# Altium schematic sheet 蓝牙钥匙球锁20714.SchDoc
size A2
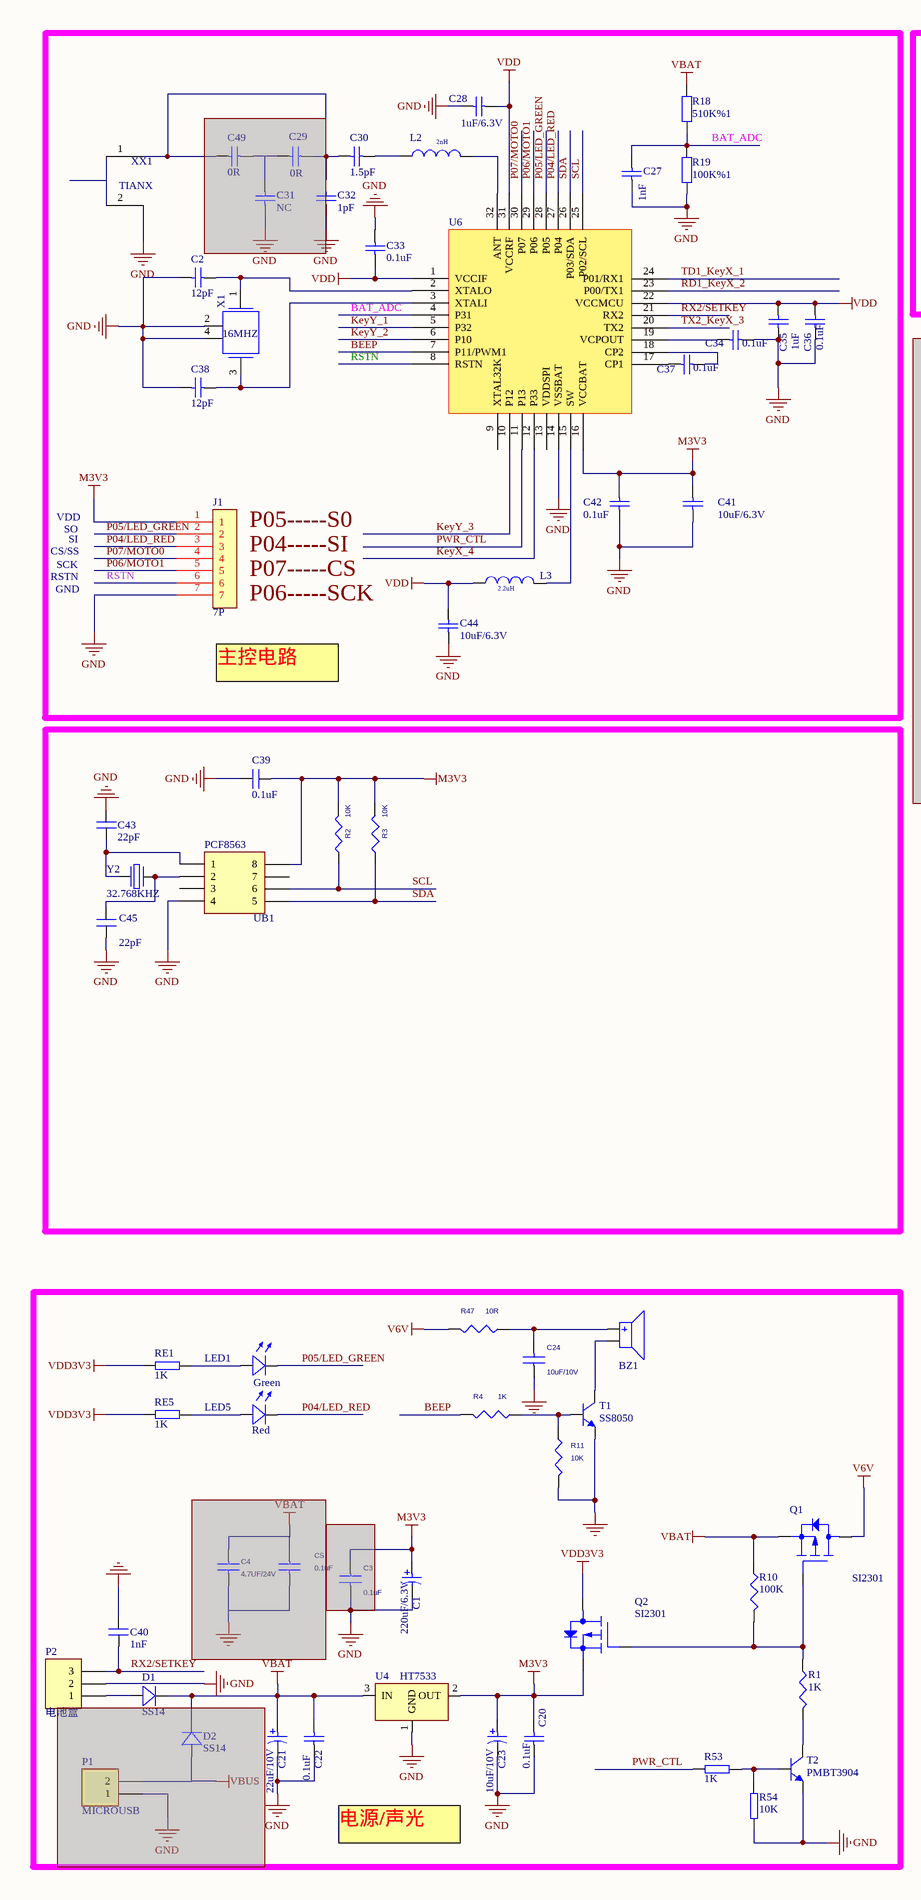
[diagram p0: 蓝牙钥匙球锁20714.SchDoc, left]
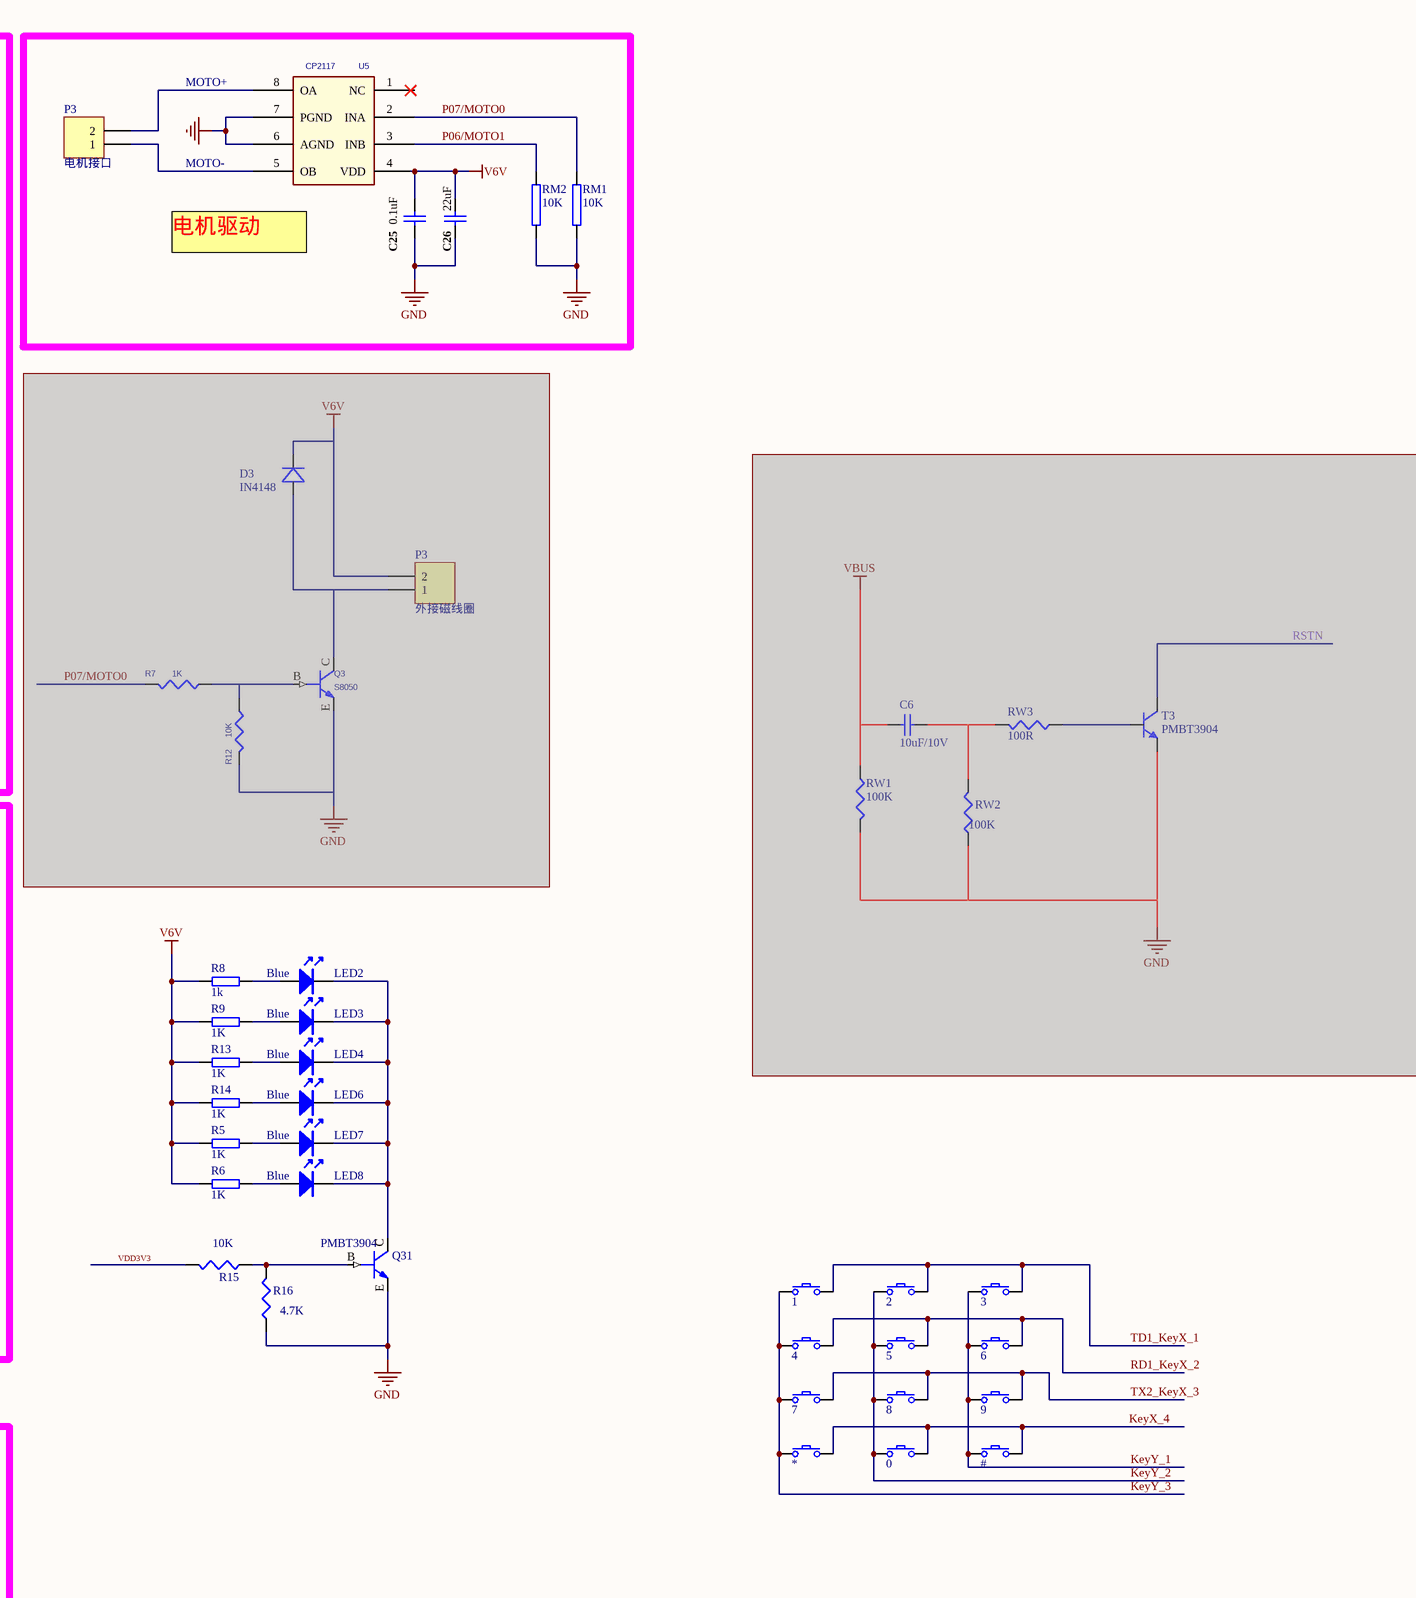
[diagram p1: 蓝牙钥匙球锁20714.SchDoc, right]

## Parts
(Parts that share a designator on the sheet are numbered #1, #2 ... from top to bottom, then left to right.)
0  SW  [KEY_5.2*3.7*6.4]  (value not drawn)
1  SW  [KEY_5.2*3.7*6.4]  (value not drawn)
2  SW  [KEY_5.2*3.7*6.4]  (value not drawn)
3  SW  [KEY_5.2*3.7*6.4]  (value not drawn)
4  SW  [KEY_5.2*3.7*6.4]  (value not drawn)
5  SW  [KEY_5.2*3.7*6.4]  (value not drawn)
6  SW  [KEY_5.2*3.7*6.4]  (value not drawn)
7  SW  [KEY_5.2*3.7*6.4]  (value not drawn)
8  SW  [KEY_5.2*3.7*6.4]  (value not drawn)
9  SW  [KEY_5.2*3.7*6.4]  (value not drawn)
#  SW  [KEY_5.2*3.7*6.4]  (value not drawn)
*  SW  [KEY_5.2*3.7*6.4]  (value not drawn)
BZ1  BUZZER  [BUZZER_D93_L40]  (value not drawn)
C1  220uF/6.3V  [R5*5.8]
C2  12pF  [0402C]
C3  0.1uF  [0402C]  (masked out: inside a compile mask, not in the netlist)
C4  4.7UF/24V  [0603C]  (masked out: inside a compile mask, not in the netlist)
C5  0.1uF  [0402C]  (masked out: inside a compile mask, not in the netlist)
C6  10uF/10V  [0603C]  (masked out: inside a compile mask, not in the netlist)
C20  0.1uF  [0402C]
C21  22uF/10V  [0603C]
C22  0.1uF  [0402C]
C23  10uF/10V  [0603C]
C24  10uF/10V  [0402C]
C25  0.1uF  [0603C]
C26  22uF  [0805C]
C27  1nF  [0402C]
C28  1uF/6.3V  [0402C]
C29  0R  [0402C]  (masked out: inside a compile mask, not in the netlist)
C30  1.5pF  [0603C]
C31  NC  [0402C]  (masked out: inside a compile mask, not in the netlist)
C32  1pF  [0603C]  (masked out: inside a compile mask, not in the netlist)
C33  0.1uF  [0402C]
C34  0.1uF  [0402C]
C35  1uF  [0402C]
C36  0.1uF  [0402C]
C37  0.1uF  [0402C]
C38  12pF  [0402C]
C39  0.1uF  [0402C]
C40  1nF  [0402C]
C41  10uF/6.3V  [0603C]
C42  0.1uF  [0402C]
C43  22pF  [0402C]
C44  10uF/6.3V  [0402C]
C45  22pF  [0402C]
C49  0R  [0402C]  (masked out: inside a compile mask, not in the netlist)
D1  SS14  [DO-214AA]
D2  SS14  [DO-214AA]  (masked out: inside a compile mask, not in the netlist)
D3  IN4148  [SOD-123]  (masked out: inside a compile mask, not in the netlist)
J1  7P  [7P-2.0MM]
L2  2nH  [0603L]
L3  2.2uH  [0603L]
LED1  Green  [0603LED]
LED2  Blue  [0603LED]
LED3  Blue  [0603LED]
LED4  Blue  [0603LED]
LED5  Red  [0603LED]
LED6  Blue  [0603LED]
LED7  Blue  [0603LED]
LED8  Blue  [0603LED]
P1  MICROUSB  [yingjix]  (masked out: inside a compile mask, not in the netlist)
P2  电池盒  [3PIN-2.0J]
P3#1  电机接口  [2-1.27]
P3#2  外接磁线圈  [B2B-PH]  (masked out: inside a compile mask, not in the netlist)
Q1  SI2301  [SOT-23 - GDS]
Q2  SI2301  [SOT-23 - GDS]
Q3  S8050  [SOT-23 - BCE]  (masked out: inside a compile mask, not in the netlist)
Q31  PMBT3904  [SOT-23 - BCE]
R1  1K  [0402R]
R2  10K  [0402R]
R3  10K  [0402R]
R4  1K  [0402R]
R5  1K  [0402R]
R6  1K  [0402R]
R7  1K  [0402R]  (masked out: inside a compile mask, not in the netlist)
R8  1k  [0402R]
R9  1K  [0402R]
R10  100K  [0402R]
R11  10K  [0402R]
R12  10K  [0402R]  (masked out: inside a compile mask, not in the netlist)
R13  1K  [0402R]
R14  1K  [0402R]
R15  10K  [0402R]
R16  4.7K  [0402R]
R18  510K%1  [0402R]
R19  100K%1  [0402R]
R47  10R  [0402R]
R53  1K  [0402R]
R54  10K  [0402R]
RE1  1K  [0402R]
RE5  1K  [0402R]
RM1  10K  [0603R]
RM2  10K  [0603R]
RW1  100K  [0402R]  (masked out: inside a compile mask, not in the netlist)
RW2  100K  [0402R]  (masked out: inside a compile mask, not in the netlist)
RW3  100R  [0402R]  (masked out: inside a compile mask, not in the netlist)
T1  SS8050  [SOT-23-3L]
T2  PMBT3904  [SOT-23-3L]
T3  PMBT3904  [SOT-23-3L]  (masked out: inside a compile mask, not in the netlist)
U4  HT7533  [SOT-23-3L]
U5  CP2117  [SOP8-2]
U6  BK3431Q  [QFN32_4*4*0.4]  (value not drawn)
UB1  PCF8563  [MSOP-8]
X1  16MHZ  [XTAL3225]
XX1  TIANX  [BT_NAMI_1]
Y2  32.768KHZ  [晶振-9]

## Nets
GND: C1.2 C2.1 C20.2 C21.2 C22.2 C23.2 C24.1 C25.2 C26.2 C27.1 C28.1 C33.1 C34.2 C35.1 C36.1 C38.1 C39.2 C40.2 C41.2 C42.2 C43.2 C44.1 C45.1 J1.7 P2.2 Q31.E(EMITTER) R11.2 R16.1 R19.2 R54.1 RM1.1 RM2.1 T1.2 T2.2 U4.1(GND) U5.6(AGND) U5.7(PGND) U6.14(VSSBAT) UB1.4 X1.2 X1.4 XX1.2
M3V3: C1.1 C20.1 C23.1 C39.1 C41.1 C42.1 J1.1 Q2.S(SOURCE) R2.1 R3.1 U4.2(OUT) U6.16(VCCBAT) UB1.8
V6V: C25.1 C26.1 Q1.D(DRAIN) R5.1 R6.1 R8.1 R9.1 R13.1 R14.1 R47.2 U5.4(VDD)
VBAT: C21.1 C22.1 D1.2(K) Q1.S(SOURCE) R10.1 R18.1 U4.3(IN)
VDD: C28.2 C33.2 C35.2 C36.2 C44.2 L3.1(P1) U6.1(VCCIF) U6.22(VCCMCU) U6.31(VCCRF)
VDD3V3: Q2.D(DRAIN) R15.2 RE1.1 RE5.1
BAT_ADC: C27.2 R18.2 R19.1 U6.4(P31)
BEEP: R4.2 U6.7(P11/PWM1)
KeyX_4: 0.2 #.2 *.2 U6.12(P33)
KeyY_1: 3.1 6.1 9.1 #.1 U6.5(P32)
KeyY_2: 0.1 2.1 5.1 8.1 U6.6(P10)
KeyY_3: 1.1 4.1 7.1 *.1 U6.10(P12)
MOTO+: P3#1.2 U5.8(OA)
MOTO-: P3#1.1 U5.5(OB)
P04/LED_RED: J1.3 LED5.2(K) U6.27(P04)
P05/LED_GREEN: J1.2 LED1.2(K) U6.28(P05)
P06/MOTO1: J1.5 RM2.2 U5.3(INB) U6.29(P06)
P07/MOTO0: J1.4 RM1.2 U5.2(INA) U6.30(P07)
PWR_CTL: R53.1 U6.11(P13)
RD1_KeyX_2: 4.2 5.2 6.2 U6.23(P00/TX1)
RSTN: J1.6 U6.8(RSTN)
RX2/SETKEY: C40.1 P2.3 U6.21(RX2)
SCL: R2.2 U6.25(P02/SCL) UB1.6
SDA: R3.2 U6.26(P03/SDA) UB1.5
TD1_KeyX_1: 1.2 2.2 3.2 U6.24(P01/RX1)
TX2_KeyX_3: 7.2 8.2 9.2 U6.20(TX2)
NetBZ1_1: BZ1.1 C24.2 R47.1
NetBZ1_2: BZ1.2 T1.3
NetC2_2: C2.2 U6.2(XTALO) X1.1
NetC30_1: C30.1 L2.1(P1)
NetC30_2: C30.2 XX1.1
NetC34_1: C34.1 U6.19(VCPOUT)
NetC37_1: C37.1 U6.17(CP1)
NetC37_2: C37.2 U6.18(CP2)
NetC38_2: C38.2 U6.3(XTALI) X1.3
NetC43_1: C43.1 UB1.1 Y2.2
NetC45_2: C45.2 UB1.2 Y2.1
NetD1_1: D1.1(A) P2.1
NetL2_2: L2.2(P2) U6.32(ANT)
NetL3_2: L3.2(P2) U6.15(SW)
NetLED1_1: LED1.1(A) RE1.2
NetLED2_1: LED2.1 R8.2
NetLED2_2: LED2.2 LED3.2 LED4.2 LED6.2 LED7.2 LED8.2 Q31.C(COLLECTOR)
NetLED3_1: LED3.1 R9.2
NetLED4_1: LED4.1 R13.2
NetLED5_1: LED5.1(A) RE5.2
NetLED6_1: LED6.1 R14.2
NetLED7_1: LED7.1 R5.2
NetLED8_1: LED8.1 R6.2
NetQ1_G: Q1.G(GATE) Q2.G(GATE) R1.1 R10.2
NetQ31_B: Q31.B(BASE) R15.1 R16.2
NetR1_2: R1.2 T2.3
NetR4_1: R4.1 R11.1 T1.1
NetR53_2: R53.2 R54.2 T2.1

Not connected (* = marked no-connect by the designer): U5 1(NC); U6 9(XTAL32K) 13(VDDSPI); UB1 3 7

## Notes on the sheet
- (near U5) 电机驱动
- VDD
- RSTN
- CS/SS
- SCK
- SO
- SI
- (near J1) P04-----SI
- (near J1) P05-----S0
- (near J1) P07-----CS
- GND
- (near J1) P06-----SCK
- 主控电路
- 电源/声光

## Library data of the parts
0-9 # * = SW: Switch
C1 C21 C23 = CAP-P: Capacitor, tolerance ±20%
C2 C28-C38 C41 C42 C44 C49 = Cap: Capacitor; Value: 10pF; Published: 8-Jun-2000; LatestRevisionDate: 17-Jul-2002; LatestRevisionNote: Re-released for DXP Platform.; PackageReference: RAD-0.3; Publisher: Altium Limited; PackageDescription: Radial Cap, Thru-Hole; 2 Leads; 0.3 in Pin Spacing
C3-C5 = CAP NP
C6 C20 C22 C25-C27 = CAP-NP: Capacitor, Ceramic; Capacitance: 18 pF; Dielectric: COG; Polarity: Non-Polarized; Rated Voltage: 50 mV; Tolerance: 5 %; Category: Capacitor; Mounting Technology: Surface Mount; Status: Unreleased; Technology: Ceramic
C24 = C_0_Dup1
C39 C40 C43 C45 = C
D1-D3 = D
L2 L3 = INDUCTOR: Power Inductor, 4.7uH, 0.7A, 260mR DCR; XMOS Part Number: E-09-0011; Manufacturer: Taiyo Yuden; Manufacturer Part Number: CBC2518T4R7M; Part Creator: JG; LEVEL: STD; DEVICE: L; FORWARD_PCB: 1; Tolerance (%): 20; Max DC Resistance: 0.26R; Rated Current (Saturation): 0.68A; Rated Current (Temp Rise): 0.92A; Approx Volume Cost ($): 0.07; Approved: NO; VALUE: 2.0nH; Datasheet: http://www.yuden.co.jp/us/product/pdf/ecb2_e.pdf; Max Height (mm): 2; Digikey Link: http://search.digikey.com/scripts/DkSearch/dksus.dll?lang=en&site=US&keywords=CBC2518T4R7M
LED1-LED8 = LED
P1 P3#1 = MHDR1X2: Header, 2-Pin; LatestRevisionDate: 17-Jul-2002; LatestRevisionNote: Re-released for DXP Platform.; Publisher: Altium Limited
P2 = Header 3: Header, 3-Pin; LatestRevisionDate: 17-Jul-2002; LatestRevisionNote: Re-released for DXP Platform.; Publisher: Altium Limited
P3#2 = Header 2: Header, 2-Pin; LatestRevisionDate: 17-Jul-2002; LatestRevisionNote: Re-released for DXP Platform.; Publisher: Altium Limited
Q1 Q2 = PWRMOSFET_EP_DGS_0
Q3 = PMBT3904_Dup1: OriginalSymbolOrigin: (0,0); ROOM: power
R1 R5 R6 R8-R10 R13-R16 R53 R54 RE1 RE5 RW1-RW3 = R
R2 R3 R7 R12 = RES
R4 R11 R47 = R_Dup1
R18 R19 = Res2: Resistor; Value: 470K; Published: 2013年12月24日; LatestRevisionDate: 2013年12月24日; LatestRevisionNote: Re-released for DXP Platform.
RM1 RM2 = Pro71C3.TMP_UnNamed_1
T1-T3 = NPN_BJT: Bipolar Junction Transistor
U4 = XC6206P302M
U5 = AM24LC02_0
UB1 = IC8
X1 = OSC: XMOS Part Number: E-07-0030; Manufacturer: Abracon; Manufacturer Part Number: ABLS-24.000MHz-B4; Part Creator: JG; LEVEL: STD; DEVICE: X; FORWARD_PCB: 1; Approx Volume Cost ($): 0.15; Approved: NO; VALUE: ABLS; FREQUENCY: 38.4MHZ; Datasheet: http://www.abracon.com/Resonators/abls.pdf; Max Height (mm): 4.2; Supplier Link: http://search.digikey.com/scripts/DkSearch/dksus.dll?lang=en&site=US&keywords=ABLS-24.000MHz-B4
Y2 = 晶振